# Altium schematic sheet AMP1.SchDoc
size A; SheetNumber: 3; SheetTotal: 6
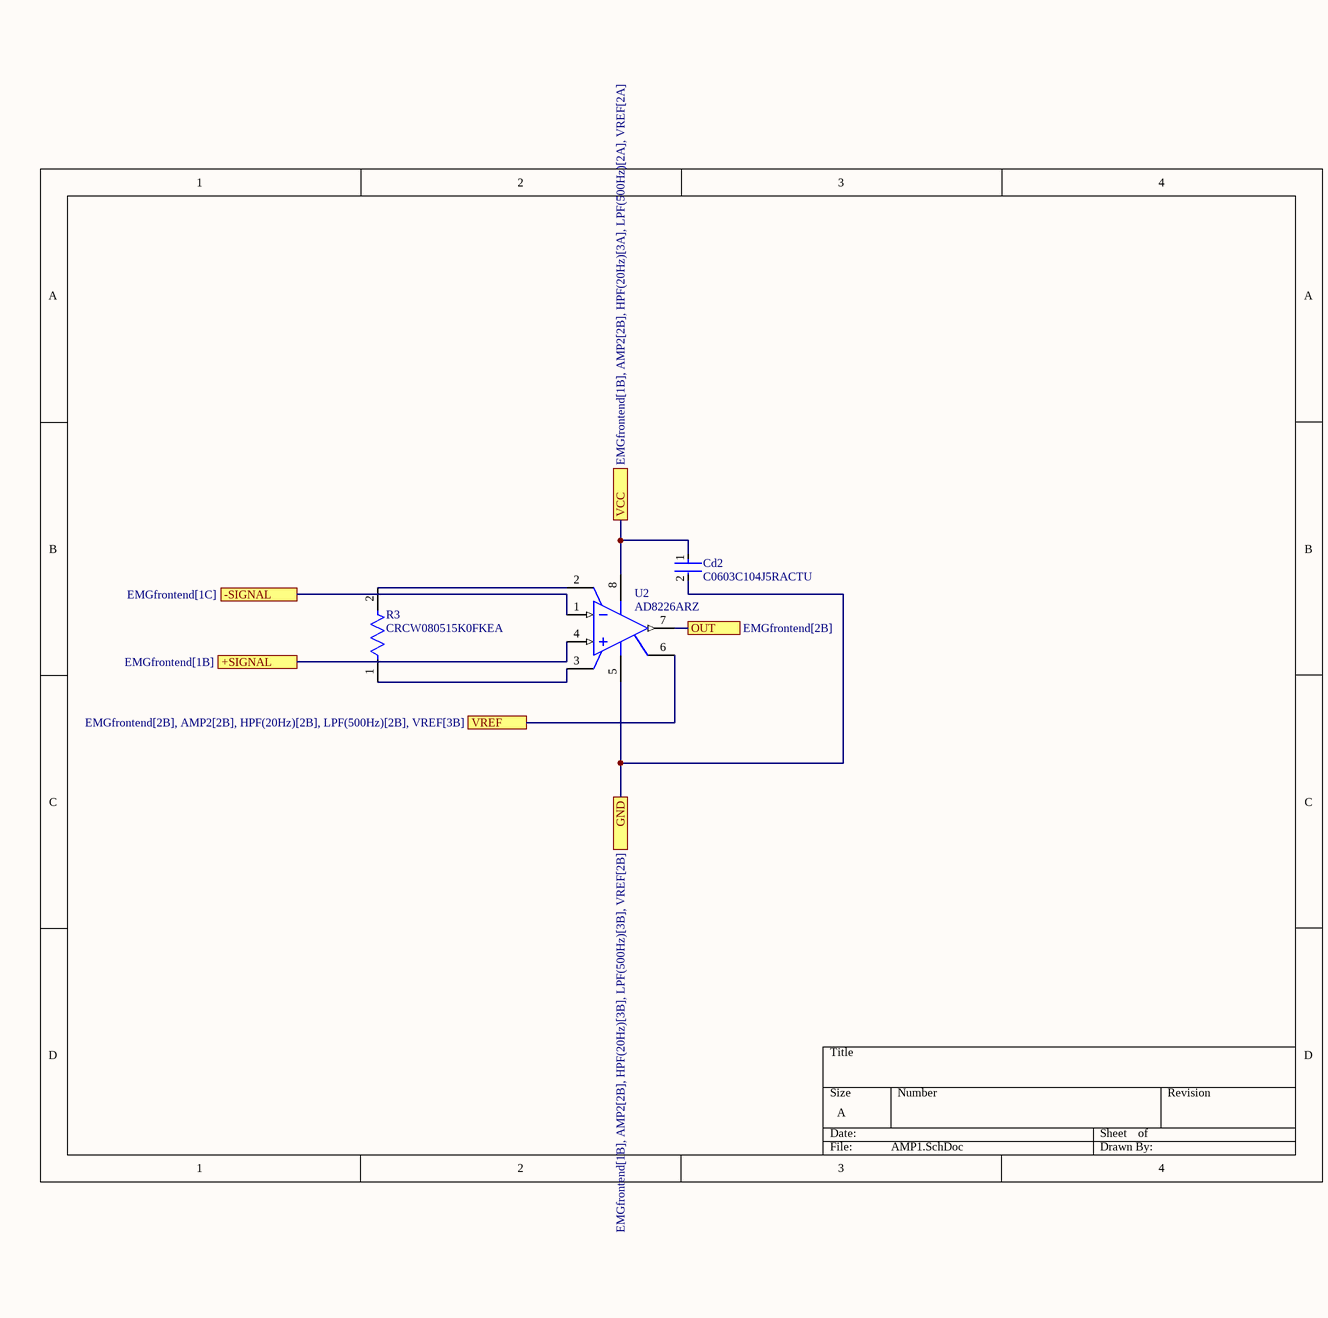
[diagram p0: AMP1.SchDoc]

## Parts
Cd2  C0603C104J5RACTU  [FP-C0603C-CF-MFG]
R3  CRCW080515K0FKEA  [FP-CRCW0805-e3-IPC_C]
U2  AD8226ARZ  [ADI-R-8_L]

## Ports
+SIGNAL (see EMGfrontend[1B]), -SIGNAL (see EMGfrontend[1C]), GND (see EMGfrontend[1B], AMP2[2B], HPF(20Hz)[3B], LPF(500Hz)[3B], VREF[2B]), OUT (see EMGfrontend[2B]), VCC (see EMGfrontend[1B], AMP2[2B], HPF(20Hz)[3A], LPF(500Hz)[2A], VREF[2A]), VREF (see EMGfrontend[2B], AMP2[2B], HPF(20Hz)[2B], LPF(500Hz)[2B], VREF[3B])

## Nets
+SIGNAL: U2.4(+IN) ; port +SIGNAL
-SIGNAL: U2.1(-IN) ; port -SIGNAL
GND: Cd2.2 U2.5(-VS) ; port GND
OUT: U2.7(VOUT) ; port OUT
VCC: Cd2.1 U2.8(+VS) ; port VCC
VREF: U2.6(REF) ; port VREF
NetR3_1: R3.1 U2.3(RG)
NetR3_2: R3.2 U2.2(RG)

## Library data of the parts
Cd2 = CMP-2006-03056-2: CAP CER 0.1UF 50V 5% X7R 0603; Manufacturer: KEMET; Automotive Grade: Grade 1; Tolerance: 0.05; Capacitance: 0.10 μF; Value: 0.10 μF; Temperature Coefficient: 30ppm/°C; ComponentLink2Description: Datasheet; Voltage Rating: 50 V; Digikey Description: CAP CER 0.1UF 50V 5% X7R 0603; Manufacturer Part Number: C0603C104J5RACTU; Temperature Range High: +125°C; Device Class L2: Capacitors; Octopart: https://octopart.com/c0603c104j5ractu-kemet-10440638; RoHS: TRUE; Mouser Description: Multilayer Ceramic Capacitors MLCC - SMD/SMT 50volts 0.1uF X7R 5%; Temperature Range Low: -55°C; Automotive: Yes; Lead Free: Yes; ComponentLink2URL: https://api.kemet.com/component-edge/download/datasheet/C0603C100J5GACAUTO.pdf; Material: Ceramic; Device Class L3: Ceramic Capacitors; Package: C0603C-CF; Category: Cap; Temperature: -55°C to +125°C; Height: 0.87mm; Temperature Characteristic: X7R; Device Class L1: Passive Components
R3 = CMP-2001-04967-2: RES Thick Film, 15kΩ, 1%, 0.125W, 100ppm/°C, 0805; Power Rating: 125mW; Voltage Rating: 150V; Resistance: 15kR; Height: 0.45mm; Number of Terminations: 2; Composition: Thick Film; Length: 2mm; Case/Package: 0805; Depth: 1.25mm; Min Operating Temperature: -55°C; Lead Free: Lead Free; Mount: Surface Mount; Package Quantity: 10; Termination: SMD/SMT; Packaging: Tape and Reel; Case Code (Metric): 2012; Features: Automotive AEC-Q200; Military Standard: Not; Width: 0.049inch; Temperature Coefficient: 100ppm/°C; Max Power Dissipation: 125mW; Weight: 0.000194oz; Tolerance: 1%; Voltage Rating (DC): 150V; Max Operating Temperature: 155°C; Radiation Hardening: No; Contact Plating: Tin; Case Code (Imperial): 0805
U2 = CMP-2000-05749-1: Wide Supply Range, Rail-to-Rail Output Instrumentation Amplifier, 2.2 to 36 V, -40 to 125 degC, 8-Pin SOIC (R-8), RoHS, Tube; Manufacturer: Analog Devices; PCN Design/Specification: PolyimideAlignmentTarget11/Aug/2015; Mfg Application Notes: AutomaticExternalDefibrillator(AED)SolutionsElectromagneticFlowMeterSolutionsMotorControlSolution—ServoControlProgrammableLogicControllers(PLCs)SolutionsElectrocardiogram(ECG)Solutions; EDA / CAD Models: DownloadfromAcceleratedDesigns; Design Resources: PLCandDCSUniversalAnalogInputUsingEither4or6-PinTerminalBlock; Current - Input Bias: 20nA; Product Training Modules: CommonPhotodiodeOp-AmpCircuitProblemsandSolutionsIndirectCurrentFeedbackInstrumentationAmplifierApplicationsGuide; -3db Bandwidth: 1.5MHz; Number of Circuits: 1; Current - Supply: 350µA; Current - Output / Channel: 13mA; Voltage - Input Offset: 100µV; Slew Rate: 0.6V/µs; Voltage - Supply, Single/Dual (±): 2.2V~36V,±1.35V~18V; Online Catalog: Instrumentation; Output Type: Rail-to-Rail; Mounting Type: SurfaceMount; Datasheet Version: Rev. C, 09/2012; Series: -; Category: IntegratedCircuits(ICs); Datasheet URL: http://www.analog.com/media/en/technical-documentation/data-sheets/AD8226.pdf; Mounting Technology: SurfaceMount; Standard Package: 98; Package / Case: 8-SOIC(0.154",3.90mmWidth); Package Description: 8-Pin Small Outline Package, Body 4.9 x 3.9 mm, Pitch 1.27 mm; Operating Temperature: -40°C~125°C; Gain Bandwidth Product: -; Manufacturer URL: http://www.analog.com/; Family: Linear-Amplifiers-Instrumentation,OPAmps,BufferAmps; Supplier Device Package: 8-SOIC; Package Reference: R-8; Amplifier Type: Instrumentation; Packaging: Tube